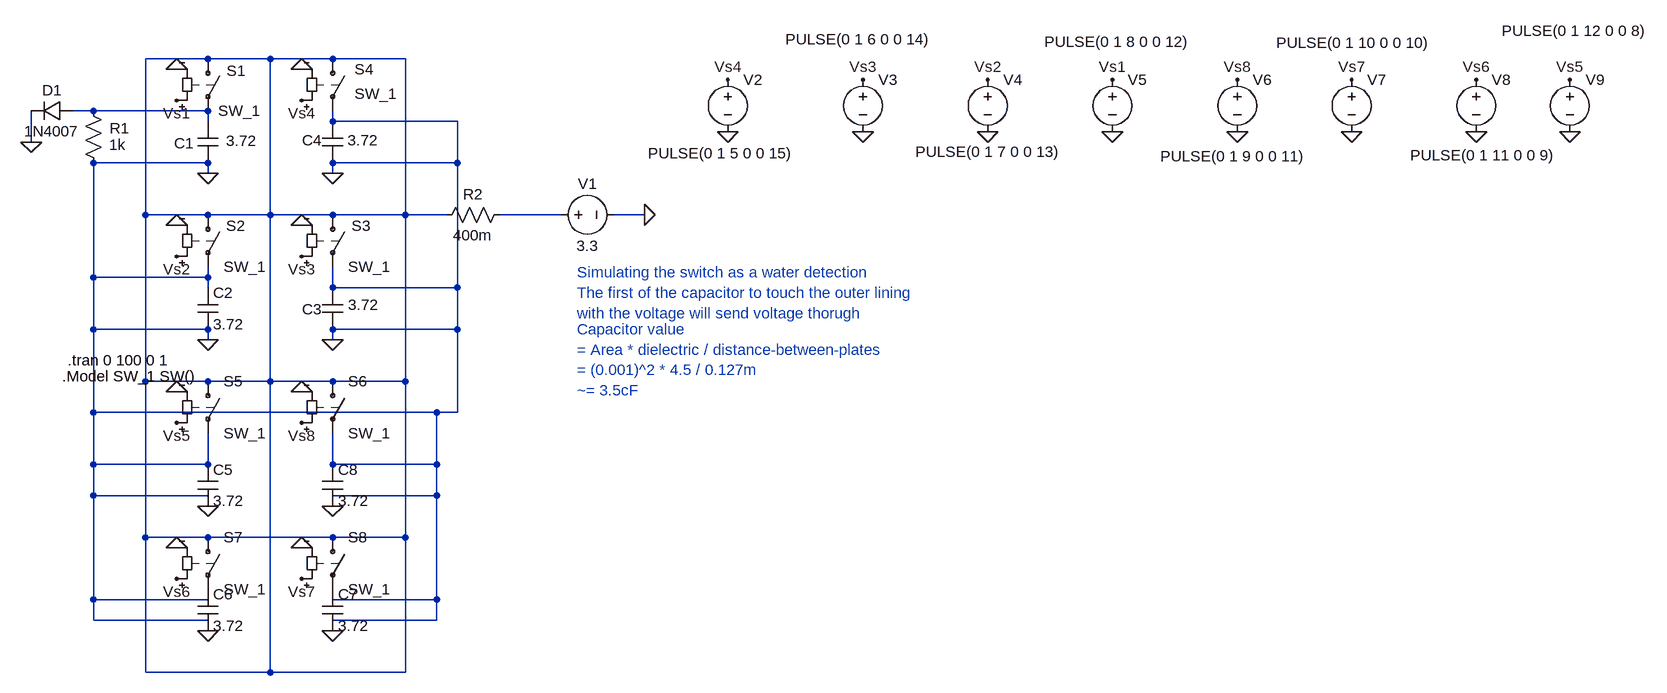
[diagram p0: schematic multi_cap_at_once_test.asc]
multi_cap_at_once_test.asc, the LTspice schematic file:
Version 4
SHEET 1 2484 1016
WIRE 128 64 32 64
WIRE 224 64 128 64
WIRE 320 64 224 64
WIRE 432 64 320 64
WIRE -48 144 -80 144
WIRE 128 144 -48 144
WIRE 128 160 128 144
WIRE 320 160 320 144
WIRE 512 160 320 160
WIRE -144 192 -144 144
WIRE 128 224 -48 224
WIRE 512 224 512 160
WIRE 512 224 320 224
WIRE 128 240 128 224
WIRE 320 240 320 224
WIRE 32 304 32 64
WIRE 128 304 32 304
WIRE 224 304 224 64
WIRE 224 304 128 304
WIRE 320 304 224 304
WIRE 432 304 432 64
WIRE 432 304 320 304
WIRE 496 304 432 304
WIRE 672 304 576 304
WIRE 800 304 752 304
WIRE -48 400 -48 224
WIRE 128 400 128 384
WIRE 128 400 -48 400
WIRE 128 416 128 400
WIRE 320 416 320 384
WIRE 512 416 512 224
WIRE 512 416 320 416
WIRE -48 480 -48 400
WIRE 128 480 -48 480
WIRE 512 480 512 416
WIRE 512 480 320 480
WIRE 128 496 128 480
WIRE 320 496 320 480
WIRE 32 560 32 304
WIRE 128 560 32 560
WIRE 224 560 224 304
WIRE 224 560 128 560
WIRE 320 560 224 560
WIRE 432 560 432 304
WIRE 432 560 320 560
WIRE -48 608 -48 480
WIRE 480 608 -48 608
WIRE 512 608 512 480
WIRE 512 608 480 608
WIRE -48 688 -48 608
WIRE 128 688 128 640
WIRE 128 688 -48 688
WIRE 320 688 320 640
WIRE 480 688 480 608
WIRE 480 688 320 688
WIRE -48 736 -48 688
WIRE 128 736 -48 736
WIRE 480 736 480 688
WIRE 480 736 320 736
WIRE 32 800 32 560
WIRE 128 800 32 800
WIRE 320 800 128 800
WIRE 432 800 432 560
WIRE 432 800 320 800
WIRE -48 896 -48 736
WIRE 128 896 -48 896
WIRE 480 896 480 736
WIRE 480 896 320 896
WIRE -48 928 -48 896
WIRE 128 928 -48 928
WIRE 480 928 480 896
WIRE 480 928 320 928
WIRE 32 1008 32 800
WIRE 224 1008 224 560
WIRE 224 1008 32 1008
WIRE 432 1008 432 800
WIRE 432 1008 224 1008
FLAG 800 304 0
FLAG 272 80 0
FLAG 272 128 Vs4
FLAG 928 96 Vs4
FLAG 928 176 0
FLAG 80 368 Vs2
FLAG 272 368 Vs3
FLAG 1136 96 Vs3
FLAG 1328 96 Vs2
FLAG 1520 96 Vs1
FLAG 1136 176 0
FLAG 1328 176 0
FLAG 1520 176 0
FLAG 80 80 0
FLAG 80 320 0
FLAG 272 320 0
FLAG -144 192 0
FLAG 128 240 0
FLAG 320 240 0
FLAG 128 496 0
FLAG 320 496 0
FLAG 80 128 Vs1
FLAG 128 944 0
FLAG 320 944 0
FLAG 320 752 0
FLAG 128 752 0
FLAG 1712 176 0
FLAG 1888 176 0
FLAG 2080 176 0
FLAG 2224 176 0
FLAG 1712 96 Vs8
FLAG 1888 96 Vs7
FLAG 2224 96 Vs5
FLAG 2080 96 Vs6
FLAG 80 576 0
FLAG 272 576 0
FLAG 272 816 0
FLAG 80 816 0
FLAG 80 624 Vs5
FLAG 272 624 Vs8
FLAG 80 864 Vs6
FLAG 272 864 Vs7
SYMBOL voltage 656 304 R270
WINDOW 0 32 56 VTop 2
WINDOW 3 -32 56 VBottom 2
WINDOW 123 0 0 Left 0
WINDOW 39 0 0 Left 0
SYMATTR InstName V1
SYMATTR Value 3.3
SYMBOL cap 304 160 R0
WINDOW 0 -31 29 Left 2
WINDOW 3 39 29 Left 2
SYMATTR InstName C4
SYMATTR Value 3.72
SYMBOL sw 320 48 R0
WINDOW 3 34 70 Left 2
WINDOW 0 34 32 Left 2
SYMATTR Value SW_1
SYMATTR InstName S4
SYMBOL voltage 928 80 R0
WINDOW 3 -123 129 Left 2
WINDOW 123 0 0 Left 0
WINDOW 39 0 0 Left 0
SYMATTR Value PULSE(0 1 5 0 0 15)
SYMATTR InstName V2
SYMBOL sw 128 48 R0
WINDOW 0 29 34 Left 2
WINDOW 3 16 96 Left 2
SYMATTR InstName S1
SYMATTR Value SW_1
SYMBOL sw 128 288 R0
WINDOW 0 28 33 Left 2
SYMATTR InstName S2
SYMATTR Value SW_1
SYMBOL sw 320 288 R0
WINDOW 0 29 33 Left 2
SYMATTR InstName S3
SYMATTR Value SW_1
SYMBOL cap 112 160 R0
WINDOW 0 -36 34 Left 2
WINDOW 3 44 30 Left 2
SYMATTR InstName C1
SYMATTR Value 3.72
SYMBOL cap 112 416 R0
SYMATTR InstName C2
SYMATTR Value 3.72
SYMBOL cap 304 416 R0
WINDOW 0 -31 33 Left 2
WINDOW 3 40 26 Left 2
SYMATTR InstName C3
SYMATTR Value 3.72
SYMBOL voltage 1136 80 R0
WINDOW 3 -119 -46 Left 2
WINDOW 123 0 0 Left 0
WINDOW 39 0 0 Left 0
SYMATTR Value PULSE(0 1 6 0 0 14)
SYMATTR InstName V3
SYMBOL voltage 1328 80 R0
WINDOW 3 -111 127 Left 2
WINDOW 123 0 0 Left 0
WINDOW 39 0 0 Left 0
SYMATTR Value PULSE(0 1 7 0 0 13)
SYMATTR InstName V4
SYMBOL voltage 1520 80 R0
WINDOW 3 -105 -42 Left 2
WINDOW 123 0 0 Left 0
WINDOW 39 0 0 Left 0
SYMATTR Value PULSE(0 1 8 0 0 12)
SYMATTR InstName V5
SYMBOL res -64 128 R0
WINDOW 0 41 43 Left 2
WINDOW 3 40 68 Left 2
SYMATTR InstName R1
SYMATTR Value 1k
SYMBOL diode -80 128 R90
WINDOW 0 0 32 VBottom 2
WINDOW 3 32 32 VTop 2
SYMATTR InstName D1
SYMATTR Value 1N4007
SYMBOL cap 112 688 R0
SYMATTR InstName C5
SYMATTR Value 3.72
SYMBOL cap 112 880 R0
SYMATTR InstName C6
SYMATTR Value 3.72
SYMBOL cap 304 880 R0
SYMATTR InstName C7
SYMATTR Value 3.72
SYMBOL cap 304 688 R0
SYMATTR InstName C8
SYMATTR Value 3.72
SYMBOL sw 128 544 R0
SYMATTR InstName S5
SYMATTR Value SW_1
SYMBOL sw 320 544 R0
SYMATTR InstName S6
SYMATTR Value SW_1
SYMBOL sw 128 784 R0
SYMATTR InstName S7
SYMATTR Value SW_1
SYMBOL sw 320 784 R0
SYMATTR InstName S8
SYMATTR Value SW_1
SYMBOL voltage 1712 80 R0
WINDOW 3 -118 134 Left 2
WINDOW 123 0 0 Left 0
WINDOW 39 0 0 Left 0
SYMATTR Value PULSE(0 1 9 0 0 11)
SYMATTR InstName V6
SYMBOL voltage 1888 80 R0
WINDOW 3 -116 -41 Left 2
WINDOW 123 0 0 Left 0
WINDOW 39 0 0 Left 0
SYMATTR Value PULSE(0 1 10 0 0 10)
SYMATTR InstName V7
SYMBOL voltage 2080 80 R0
WINDOW 3 -102 132 Left 2
WINDOW 123 0 0 Left 0
WINDOW 39 0 0 Left 0
SYMATTR Value PULSE(0 1 11 0 0 9)
SYMATTR InstName V8
SYMBOL voltage 2224 80 R0
WINDOW 3 -105 -59 Left 2
WINDOW 123 0 0 Left 0
WINDOW 39 0 0 Left 0
SYMATTR Value PULSE(0 1 12 0 0 8)
SYMATTR InstName V9
SYMBOL res 592 288 R90
WINDOW 0 0 56 VBottom 2
WINDOW 3 32 56 VTop 2
SYMATTR InstName R2
SYMATTR Value 400m
TEXT -96 552 Left 2 !.Model SW_1 SW()
TEXT -88 528 Left 2 !.tran 0 100 0 1
TEXT 696 424 Left 2 ;The first of the capacitor to touch the outer lining\nwith the voltage will send voltage thorugh
TEXT 696 392 Left 2 ;Simulating the switch as a water detection
TEXT 696 480 Left 2 ;Capacitor value \n= Area * dielectric / distance-between-plates \n= (0.001)^2 * 4.5 / 0.127m \n~= 3.5cF

The netlist it stands for:
* multi_cap_at_once_test.asc
V1 N003 0 3.3
C4 0 0 3.72
S4 N001 0 Vs4 0 SW_1
V2 Vs4 0 PULSE(0 1 5 0 0 15)
S1 N001 N002 Vs1 0 SW_1
S2 N001 0 Vs2 0 SW_1
S3 N001 0 Vs3 0 SW_1
C1 N002 0 3.72
C2 0 0 3.72
C3 0 0 3.72
V3 Vs3 0 PULSE(0 1 6 0 0 14)
V4 Vs2 0 PULSE(0 1 7 0 0 13)
V5 Vs1 0 PULSE(0 1 8 0 0 12)
R1 N002 0 1k
D1 N002 0 1N4007
C5 0 0 3.72
C6 P001 0 3.72
C7 P002 0 3.72
C8 0 0 3.72
S5 N001 0 Vs5 0 SW_1
S6 N001 0 Vs8 0 SW_1
S7 N001 P001 Vs6 0 SW_1
S8 N001 P002 Vs7 0 SW_1
V6 Vs8 0 PULSE(0 1 9 0 0 11)
V7 Vs7 0 PULSE(0 1 10 0 0 10)
V8 Vs6 0 PULSE(0 1 11 0 0 9)
V9 Vs5 0 PULSE(0 1 12 0 0 8)
R2 N003 N001 400m
.model D D
.lib standard.dio
.Model SW_1 SW()
.tran 0 100 0 1
* The first of the capacitor to touch the outer lining
* with the voltage will send voltage thorugh
* Simulating the switch as a water detection
* Capacitor value
* = Area * dielectric / distance-between-plates
* = (0.001)^2 * 4.5 / 0.127m
* ~= 3.5cF
.backanno
.end